# Altium project Joystick.PrjPcb
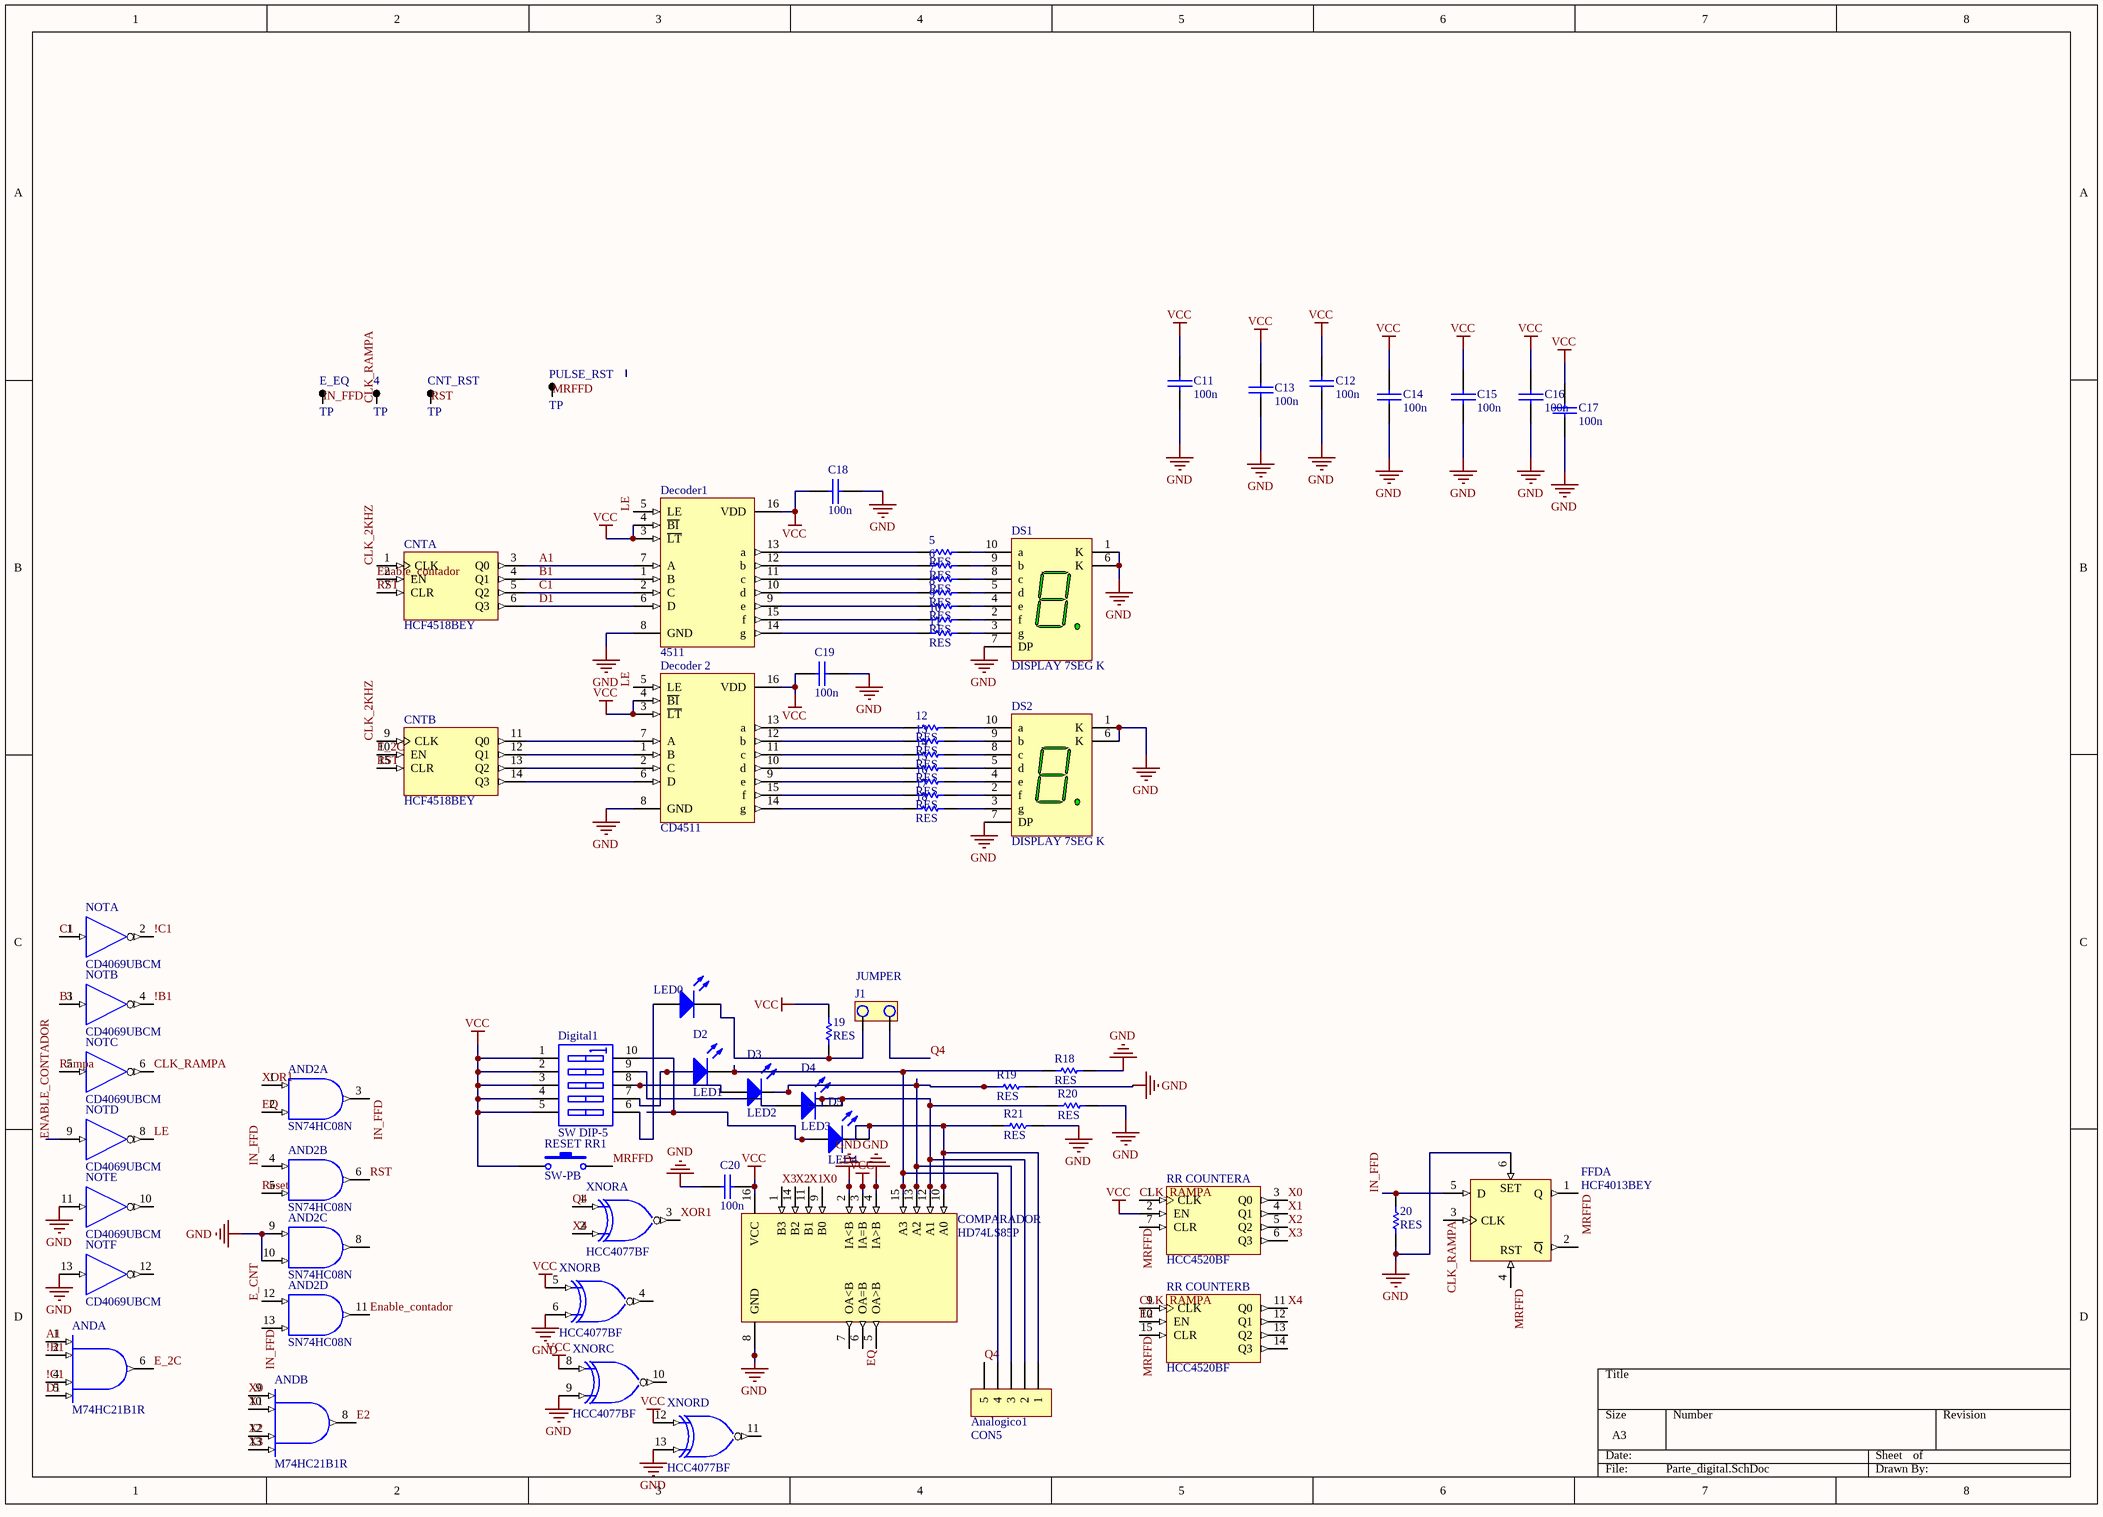
[diagram p0: Parte_digital.SchDoc]
2 sheets, 92 parts. Net scope: global (net labels, ports and power ports of the same name join across sheets).
Board files: Parte_digital.PcbDoc, PCB.PcbDoc
Sheets:
  Parte_digital.SchDoc
  Esquematico.SchDoc

## Sheet Parte_digital.SchDoc
size A3

### Parts
4  TP  [TPTH]
5  RES  [AXIAL-0.3]
6  RES  [AXIAL-0.3]
7  RES  [AXIAL-0.3]
8  RES  [AXIAL-0.3]
9  RES  [AXIAL-0.3]
10  RES  [AXIAL-0.3]
11  RES  [AXIAL-0.3]
12  RES  [AXIAL-0.3]
13  RES  [AXIAL-0.3]
14  RES  [AXIAL-0.3]
15  RES  [AXIAL-0.3]
16  RES  [AXIAL-0.3]
17  RES  [AXIAL-0.3]
18  RES  [AXIAL-0.3]
19  RES  [AXIAL-0.3]
20  RES  [AXIAL-0.3]
Analogico1  CON5  [SIP5]
AND  M74HC21B1R  [DIP14]  (parts A,B of 2)
AND2  SN74HC08N  [N014]  (parts A,B,C,D of 4)
C11  100n  [0805]
C12  100n  [0805]
C13  100n  [0805]
C14  100n  [0805]
C15  100n  [0805]
C16  100n  [0805]
C17  100n  [0805]
C18  100n  [0805]
C19  100n  [0805]
C20  100n  [0805]
CNT  HCF4518BEY  [DIP16]  (parts A,B of 2)
CNT_RST  TP  [TPTH]
COMPARADOR  HD74LS85P  [PRDP0016AE-B]
D1  LED0  [LED3]
D2  LED1  [LED3]
D3  LED2  [LED3]
D4  LED3  [LED3]
D5  LED4  [LED3]
Decoder1  4511  [DIP16]
Decoder_2  CD4511  [DIP16]
Digital1  SW DIP-5  [N10A]
DS1  DISPLAY 7SEG K  [DISPLAY_LED_0.3"]
DS2  DISPLAY 7SEG K  [DISPLAY_LED_0.3"]
E_EQ  TP  [TPTH]
FFD  HCF4013BEY  [DIP14]  (part A of 2)
J1  JUMPER  [JUMPER2]
NOT  CD4069UBCM  [DIP14]  (parts A,B,C,D,E,F of 6)
PULSE_RST  TP  [TPTH]
R18  RES  [AXIAL-0.3]
R19  RES  [AXIAL-0.3]
R20  RES  [AXIAL-0.3]
R21  RES  [AXIAL-0.3]
RESET_RR1  SW-PB  [SPST-2]
RR_COUNTER  HCC4520BF  [DIP16]  (parts A,B of 2)
XNOR  HCC4077BF  [CDIP14]  (parts A,B,C,D of 4)

### Nets
GND: 20.2 AND.7(GND) AND2.7(GND) AND2.9(A) AND2.10(B) C11.2 C12.2 C13.2 C14.2 C15.2 C16.2 C17.2 C18.2 C19.2 C20.2 CNT.8(GND) COMPARADOR.2(IA<B) COMPARADOR.4(IA>B) COMPARADOR.8(GND) Decoder1.8(GND) Decoder_2.8(GND) DS1.1(K) DS1.6(K) DS1.7(DP) DS2.1(K) DS2.6(K) DS2.7(DP) FFD.6(S) FFD.7(GND) NOT.7(GND) NOT.11(I) NOT.13(I) R18.1 R19.1 R20.1 R21.1 RR_COUNTER.8(GND) XNOR.6(D) XNOR.7(GND) XNOR.9(F) XNOR.13(H)
VCC: 19.2 AND.14(VCC) AND2.14(VCC) C11.1 C12.1 C13.1 C14.1 C15.1 C16.1 C17.1 C18.1 C19.1 C20.1 COMPARADOR.3(IA=B) COMPARADOR.16(VCC) Decoder1.3(~{LT}) Decoder1.4(~{BI}) Decoder1.16(VDD) Decoder_2.3(~{LT}) Decoder_2.4(~{BI}) Decoder_2.16(VDD) Digital1.1(A1) Digital1.2(A2) Digital1.3(A3) Digital1.4(A4) Digital1.5(A5) RESET_RR1.1 RR_COUNTER.2(EN) XNOR.5(C) XNOR.8(E) XNOR.12(G) XNOR.14(VCC)
VDD: CNT.16(VDD) FFD.14(VDD) NOT.14(VDD) RR_COUNTER.16(VDD)
!B1: AND.2(B) NOT.4(O)
!C1: AND.4(C) NOT.2(O)
A1: AND.1(A) CNT.3(Q0) Decoder1.7(A)
B1: CNT.4(Q1) Decoder1.1(B) NOT.3(I)
C1: CNT.5(Q2) Decoder1.2(C) NOT.1(I)
CLK_2KHZ: CNT.1(CLK) CNT.9(CLK)
CLK_RAMPA: 4.1 FFD.3(CLK) NOT.6(O) RR_COUNTER.1(CLK) RR_COUNTER.9(CLK)
D1: AND.5(D) CNT.6(Q3) Decoder1.6(D)
E2: AND.8(Y) RR_COUNTER.10(EN)
E_2C: AND.6(Y) CNT.10(EN)
E_CNT: AND2.12(A)
Enable_contador: AND2.11(Y) CNT.2(EN) NOT.9(I)
EQ: AND2.2(B) COMPARADOR.6(OA=B)
IN_FFD: 20.1 AND2.3(Y) AND2.4(A) AND2.13(B) E_EQ.1 FFD.5(D)
LE: Decoder1.5(LE) Decoder_2.5(LE) NOT.8(O)
MRFFD: FFD.1(Q) FFD.4(RST) PULSE_RST.1 RESET_RR1.2 RR_COUNTER.7(CLR) RR_COUNTER.15(CLR)
Q4: Analogico1.5 J1.1 XNOR.1(A)
Rampa: NOT.5(I)
Reset: AND2.5(B)
RST: AND2.6(Y) CNT.7(CLR) CNT.15(CLR) CNT_RST.1
X0: AND.9(A) COMPARADOR.9(B0) RR_COUNTER.3(Q0)
X1: AND.10(B) COMPARADOR.11(B1) RR_COUNTER.4(Q1)
X2: AND.12(C) COMPARADOR.14(B2) RR_COUNTER.5(Q2)
X3: AND.13(D) COMPARADOR.1(B3) RR_COUNTER.6(Q3)
X4: RR_COUNTER.11(Q0) XNOR.2(B)
XOR1: AND2.1(A) XNOR.3(J)
Net5_1: 5.1 Decoder1.13(a)
Net5_2: 5.2 DS1.10(a)
Net6_1: 6.1 Decoder1.12(b)
Net6_2: 6.2 DS1.9(b)
Net7_1: 7.1 Decoder1.11(c)
Net7_2: 7.2 DS1.8(c)
Net8_1: 8.1 Decoder1.10(d)
Net8_2: 8.2 DS1.5(d)
Net9_1: 9.1 Decoder1.9(e)
Net9_2: 9.2 DS1.4(e)
Net10_1: 10.1 Decoder1.15(f)
Net10_2: 10.2 DS1.2(f)
Net11_1: 11.1 Decoder1.14(g)
Net11_2: 11.2 DS1.3(g)
Net12_1: 12.1 Decoder_2.13(a)
Net12_2: 12.2 DS2.10(a)
Net13_1: 13.1 Decoder_2.12(b)
Net13_2: 13.2 DS2.9(b)
Net14_1: 14.1 Decoder_2.11(c)
Net14_2: 14.2 DS2.8(c)
Net15_1: 15.1 Decoder_2.10(d)
Net15_2: 15.2 DS2.5(d)
Net16_1: 16.1 Decoder_2.9(e)
Net16_2: 16.2 DS2.4(e)
Net17_1: 17.1 Decoder_2.15(f)
Net17_2: 17.2 DS2.2(f)
Net18_1: 18.1 Decoder_2.14(g)
Net18_2: 18.2 DS2.3(g)
Net19_1: 19.1 D1.2(K) J1.2
NetAnalogico1_1: Analogico1.1 COMPARADOR.10(A0) D5.2(K) R21.2
NetAnalogico1_2: Analogico1.2 COMPARADOR.12(A1) D4.2(K) R20.2
NetAnalogico1_3: Analogico1.3 COMPARADOR.13(A2) D3.2(K) R19.2
NetAnalogico1_4: Analogico1.4 COMPARADOR.15(A3) D2.2(K) R18.2
NetCNT_11: CNT.11(Q0) Decoder_2.7(A)
NetCNT_12: CNT.12(Q1) Decoder_2.1(B)
NetCNT_13: CNT.13(Q2) Decoder_2.2(C)
NetCNT_14: CNT.14(Q3) Decoder_2.6(D)
NetD1_1: D1.1(A) Digital1.6(B5)
NetD2_1: D2.1(A) Digital1.7(B4)
NetD3_1: D3.1(A) Digital1.8(B3)
NetD4_1: D4.1(A) Digital1.9(B2)
NetD5_1: D5.1(A) Digital1.10(B1)

Not connected (* = marked no-connect by the designer): AND2 8(Y); COMPARADOR 5(OA>B) 7(OA<B); FFD 2(~{Q}); NOT 10(O) 12(O); RR_COUNTER 12(Q1) 13(Q2) 14(Q3); XNOR 4(K) 10(L) 11(M)

### Notes on the sheet
- (in symbol HCF4013BEY, part A) SET

### Library data of the parts
AND = M74HC21B1R: Dual 4-Input AND Gate; Note: Pins 3 and 11 are not connected and not drawn.; Published: 8-Jun-2000; LatestRevisionDate: 06-Jun-2005; LatestRevisionNote: Stylized 3D Model Added.; DatasheetVersion: Dec-1992; PackageVersion: Jan-1997; PackageReference: DIP14; Publisher: Altium Limited; PackageDescription: DIP; 14 Leads; Row Spacing 7.62 mm; Pitch 2.54 mm; ComponentLink1Description: Manufacturer Link; ComponentLink1URL: http://www.st.com/; ComponentLink2Description: Datasheet; ComponentLink2URL: http://www.st.com/stonline/products/literature/ds/1923/m74hc21.pdf
AND2 = SN74HC08N: Quadruple 2-Input Positive-AND Gate; Published: 8-Jun-2000; LatestRevisionDate: 04-Mar-2005; LatestRevisionNote: Stylized 3D Model Added.; DatasheetVersion: May-1997; PackageVersion: Oct-1995; PackageReference: N014; Publisher: Altium Limited; PackageDescription: DIP; 14 Leads; Row Spacing 7.62 mm; Pitch 2.54 mm; ComponentLink1Description: Manufacturer Link; ComponentLink1URL: http://www.ti.com/; ComponentLink2Description: Datasheet; ComponentLink2URL: http://www-s.ti.com/sc/ds/SN74HC08.pdf
C11-C20 = CAP
CNT = HCF4518BEY: Dual Up-Counter; Published: 8-Jun-2000; LatestRevisionDate: 06-Jun-2005; LatestRevisionNote: Stylized 3D Model Added.; DatasheetVersion: Jun-1989; PackageVersion: Apr-1996; PackageReference: DIP16; Publisher: Altium Limited; PackageDescription: DIP; 16 Leads; Row Spacing 7.62 mm; Pitch 2.54 mm; ComponentLink1Description: Manufacturer Link; ComponentLink1URL: http://www.st.com/; ComponentLink2Description: Datasheet; ComponentLink2URL: http://www.st.com/stonline/products/literature/ds/2082/hcf4518.pdf
COMPARADOR = HD74LS85P: 4-bit Magnitude Comparator; Published: 10-Feb-2010; DatasheetVersion: Rev.2.00, Feb-2005; PackageVersion: Sep-2005; PackageReference: PRDP0016AE-B; Publisher: Altium Limited; PackageDescription: DIP, Plastic, 16-Pin, Row Spacing 7.62 mm, Pitch 2.54 mm; Code_JEITA: P-DIP16-6.3x19.2-2.54; ComponentLink1Description: Manufacturer Link; ComponentLink1URL: http://sg.renesas.com/fmwk.jsp?cnt=hd74ls_root.jsp&fp=/products/standard_ic/general_purpose_logic/5v_standard_logic/hd74ls/; ComponentLink2Description: Datasheet; ComponentLink2URL: http://documentation.renesas.com/eng/products/logic/rej03d0421_hd74ls85.pdf; ComponentLink3Description: Packaging Specification; ComponentLink3URL: http://sg.renesas.com/media/products/common_info/package/pdf/ic/code/prdp0016ae_b.pdf
D1-D5 = LED0: Typical INFRARED GaAs LED; Published: 8-Jun-2000; LatestRevisionDate: 08-Jul-2005; LatestRevisionNote: Mech Layer 1 removed.; PackageReference: LED-0; Publisher: Altium Limited; PackageDescription: LED; 2 Leads
Decoder1 Decoder_2 = CD4511: BCD to 7 SEGMENTOS
Digital1 = SW DIP-5: DIP Switch, 5 Position, SPST; Published: 24-Mar-1999; LatestRevisionDate: 17-Jul-2002; LatestRevisionNote: Re-released for DXP Platform.; PackageReference: N10A; Publisher: Altium Limited
DS1 DS2 = DISPLAY 7SEG K: Display 7 Segmentos Catodo Común
FFD = HCF4013BEY: Dual D-Type Flip-Flop; Published: 8-Jun-2000; LatestRevisionDate: 06-Jun-2005; LatestRevisionNote: Stylized 3D Model Added.; DatasheetVersion: Jun-1989; PackageVersion: Jan-1997; PackageReference: DIP14; Publisher: Altium Limited; PackageDescription: DIP; 14 Leads; Row Spacing 7.62 mm; Pitch 2.54 mm; ComponentLink1Description: Manufacturer Link; ComponentLink1URL: http://www.st.com/; ComponentLink2Description: Datasheet; ComponentLink2URL: http://www.st.com/stonline/products/literature/ds/2023/hcf4013.pdf
NOT = CD4069UBCM: Hex Inverter, 14-Pin SOIC; IC_Technology: C; Published: 17-Jul-2002; LatestRevisionDate: 13-Apr-2006; LatestRevisionNote: IPC-7351 Footprint Added.; DatasheetVersion: Jan-1999; PackageVersion: 2000; PackageReference: M14A; Publisher: Altium Limited; PackageDescription: 14-Pin Small Outline Integrated Circuit 1.27 mm Pitch; Code_IPC: SOIC127P600-14; ComponentLink1Description: Manufacturer Link; ComponentLink1URL: http://www.fairchildsemi.com/; ComponentLink2Description: Datasheet; ComponentLink2URL: http://www.fairchildsemi.com/ds/CD%2FCD4069UBC.pdf
RESET_RR1 = SW-PB: Switch; Published: 24-Mar-1999; LatestRevisionDate: 17-Jul-2002; LatestRevisionNote: Re-released for DXP Platform.; PackageReference: SPST-2; Publisher: Altium Limited; PackageDescription: Switch; 2 Leads
RR_COUNTER = HCC4520BF: Dual Binary Up-Counter; Published: 8-Jun-2000; LatestRevisionDate: 06-Jun-2005; LatestRevisionNote: Stylized 3D Model Added.; DatasheetVersion: Jun-1989; PackageVersion: Apr-1996; PackageReference: DIP16; Publisher: Altium Limited; PackageDescription: DIP; 16 Leads; Row Spacing 7.62 mm; Pitch 2.54 mm; ComponentLink1Description: Manufacturer Link; ComponentLink1URL: http://www.st.com/
XNOR = HCC4077BF: Quad Exclusive NOR Gate; Published: 8-Jun-2000; LatestRevisionDate: 06-Jun-2005; LatestRevisionNote: Stylized 3D Model Added.; DatasheetVersion: Sep-1988; PackageReference: CDIP14; Publisher: Altium Limited; PackageDescription: DIP; 14 Leads; Row Spacing 7.62 mm; Pitch 2.54 mm; ComponentLink1Description: Manufacturer Link; ComponentLink1URL: http://www.st.com/

## Sheet Esquematico.SchDoc
size A3
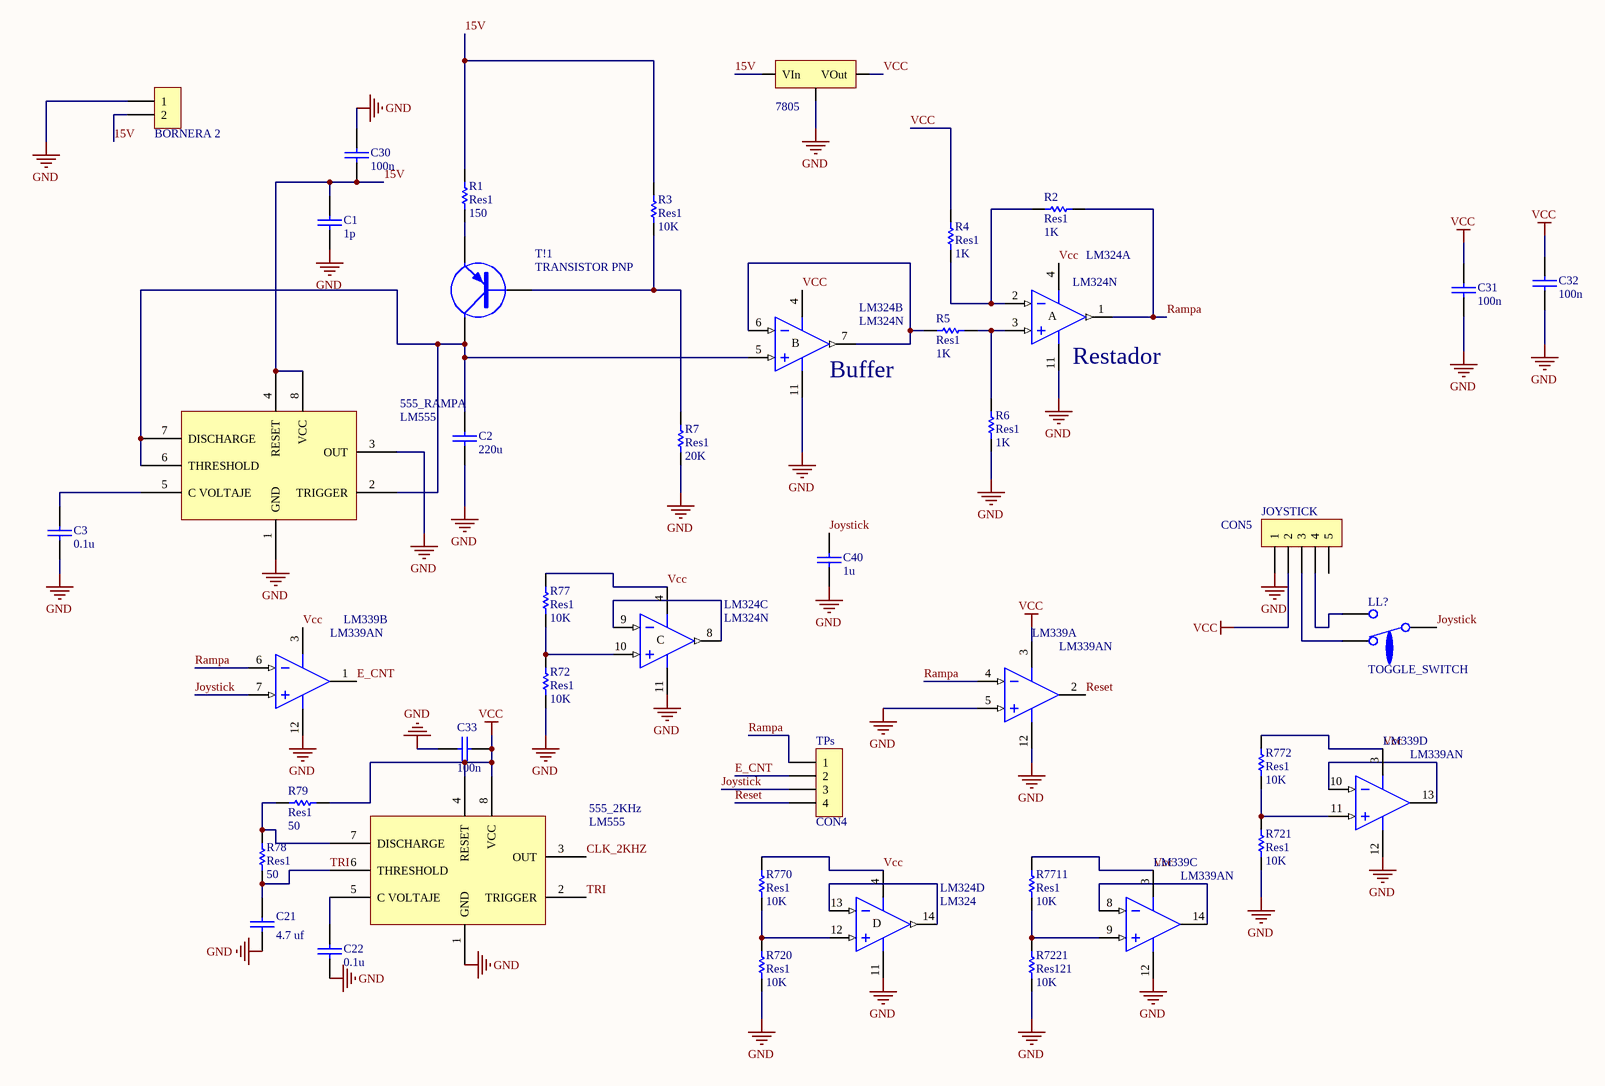
[diagram p1: Esquematico.SchDoc]

### Parts
555_2KHz  LM555  [DIP8]
555_RAMPA  LM555  [DIP8]
Alimentacion1  BORNERA 2  [BORNERA2]
C1  1p  [CAP100]
C2  220u  [CAP100]
C3  0.1u  [CAP100]
C21  4.7 uf  [CAP100]
C22  0.1u  [CAP100]
C30  100n  [0805]
C31  100n  [0805]
C32  100n  [0805]
C33  100n  [0805]
C40  1u  [CAP200]
JOYSTICK  CON5  [SIP5]
LL?  TOGGLE_SWITCH  [TOOGLE SWITCH SIMPLE]
LM324  LM324N  [N014]  (parts A,B,C,D of 4)
LM339  LM339AN  [646-06]  (parts A,B,C,D of 4)
R1  Res1  value 150  [AXIAL-0.3]
R2  Res1  value 1K  [AXIAL-0.3]
R3  Res1  value 10K  [AXIAL-0.3]
R4  Res1  value 1K  [AXIAL-0.3]
R5  Res1  value 1K  [AXIAL-0.3]
R6  Res1  value 1K  [AXIAL-0.3]
R7  Res1  value 20K  [AXIAL-0.3]
R72  Res1  value 10K  [AXIAL-0.3]
R77  Res1  value 10K  [AXIAL-0.3]
R78  Res1  value 50  [AXIAL-0.3]
R79  Res1  value 50  [AXIAL-0.3]
R720  Res1  value 10K  [AXIAL-0.3]
R721  Res1  value 10K  [AXIAL-0.3]
R770  Res1  value 10K  [AXIAL-0.3]
R772  Res1  value 10K  [AXIAL-0.3]
R7221  Res121  value 10K  [AXIAL-0.3]
R7711  Res1  value 10K  [AXIAL-0.3]
Regulador_de_Tensión  7805  [TO-220 V]
T!1  TRANSISTOR PNP  [TO92]
TPs  CON4  [SIP4]

### Nets
GND: 555_2KHz.1(GND) 555_RAMPA.1(GND) 555_RAMPA.3(OUT) Alimentacion1.1 C1.2 C2.2 C3.2 C21.2 C22.2 C30.2 C31.2 C32.2 C33.2 C40.2 JOYSTICK.1 LM324.11(V-) LM339.5(IN+) LM339.12(GND) R6.1 R7.1 R72.1 R720.1 R721.1 R7221.1 Regulador_de_Tensión.2(GND)
VCC: 555_2KHz.4(RESET) 555_2KHz.8(VCC) C31.1 C32.1 C33.1 JOYSTICK.2 LM324.4(V+) LM339.3(V+) R4.2 R77.2 R79.1 R770.2 R772.2 R7711.2 Regulador_de_Tensión.3(VOut)
15V: 555_RAMPA.4(RESET) 555_RAMPA.8(VCC) Alimentacion1.2 C1.1 C30.1 R1.2 R3.2 Regulador_de_Tensión.1(VIn)
CLK_2KHZ: 555_2KHz.3(OUT)
E_CNT: LM339.1(OUT) TPs.2
Joystick: C40.1 LL?.2(C) LM339.7(IN+) TPs.3
Rampa: LM324.1(OUT) LM339.4(IN-) LM339.6(IN-) R2.1 TPs.1
Reset: LM339.2(OUT) TPs.4
TRI: 555_2KHz.2(TRIGGER) 555_2KHz.6(THRESHOLD) C21.1 R78.1
Net555_2KHz_5: 555_2KHz.5(C_VOLTAJE) C22.1
Net555_2KHz_7: 555_2KHz.7(DISCHARGE) R78.2 R79.2
Net555_RAMPA_2: 555_RAMPA.2(TRIGGER) 555_RAMPA.6(THRESHOLD) 555_RAMPA.7(DISCHARGE) C2.1 LM324.5(IN+) T!1.2(C)
Net555_RAMPA_5: 555_RAMPA.5(C_VOLTAJE) C3.1
NetJOYSTICK_3: JOYSTICK.3 LL?.3(NC)
NetJOYSTICK_4: JOYSTICK.4 LL?.1(NA)
NetLM324_2: LM324.2(IN-) R2.2 R4.1
NetLM324_3: LM324.3(IN+) R5.1 R6.2
NetLM324_6: LM324.6(IN-) LM324.7(OUT) R5.2
NetLM324_8: LM324.8(OUT) LM324.9(IN-)
NetLM324_10: LM324.10(IN+) R72.2 R77.1
NetLM324_12: LM324.12(IN+) R720.2 R770.1
NetLM324_13: LM324.13(IN-) LM324.14(OUT)
NetLM339_8: LM339.8(IN-) LM339.14(OUT)
NetLM339_9: LM339.9(IN+) R7221.2 R7711.1
NetLM339_10: LM339.10(IN-) LM339.13(OUT)
NetLM339_11: LM339.11(IN+) R721.2 R772.1
NetR1_1: R1.1 T!1.3(E)
NetR3_1: R3.1 R7.2 T!1.1(B)

Not connected (* = marked no-connect by the designer): JOYSTICK 5

### Notes on the sheet
- (near LM324) Buffer
- (near LM324) Restador
- (in symbol LM324N, part A) A
- (in symbol LM324N, part B) B
- (in symbol LM324N, part C) C
- (in symbol LM324N, part D) D

### Library data of the parts
555_2KHz 555_RAMPA = LM555: Timer
C1-C3 C21 C22 C30-C33 C40 = CAP
LL? = TOGGLE_SWITCH: Pulsador con reteción
LM324 = LM324N: Quadruple Operational Amplifier; Published: 16-Jan-2001; LatestRevisionDate: 04-Mar-2005; LatestRevisionNote: Stylized 3D Model Added.; DatasheetVersion: Feb-1997; PackageVersion: Oct-1995; PackageReference: N014; Publisher: Altium Limited; PackageDescription: DIP; 14 Leads; Row Spacing 7.62 mm; Pitch 2.54 mm; ComponentLink1Description: Manufacturer Link; ComponentLink1URL: http://www.ti.com/; ComponentLink2Description: Datasheet; ComponentLink2URL: http://www-s.ti.com/sc/ds/lm324.pdf
LM339 = LM339AN: Quad Single-Supply Comparator; Published: 17-Jul-2002; LatestRevisionDate: 06-Jun-2005; LatestRevisionNote: Stylized 3D Model Added.; DatasheetVersion: 1988; PackageVersion: 1997; PackageReference: 646-06; Publisher: Altium Limited; PackageDescription: DIP; 14 Leads; Row Spacing 7.62 mm; Pitch 2.54 mm; ComponentLink1Description: Manufacturer Link; ComponentLink1URL: http://www.onsemi.com/site/products/taxonomy/0,4438,133,00.html
R1-R7 R72 R77-R79 R720 R721 R770 R772 R7221 R7711 = Res1: Resistor; Published: 8-Jun-2000; LatestRevisionDate: 17-Jul-2002; LatestRevisionNote: Re-released for DXP Platform.; PackageReference: AXIAL-0.3; Publisher: Altium Limited; PackageDescription: Axial Device, Thru-Hole; 2 Leads; 0.3 in Pin Spacing
Regulador_de_Tensión = 78XX: REGULDOR POSITIVO

## Nets that join several sheets
GND: Parte_digital (41 pins), Esquematico (25 pins)
VCC: Parte_digital (32 pins), Esquematico (15 pins)
CLK_2KHZ: Parte_digital (CNT.1 CNT.9), Esquematico (555_2KHz.3)
E_CNT: Parte_digital (AND2.12), Esquematico (LM339.1 TPs.2)
Rampa: Parte_digital (NOT.5), Esquematico (5 pins)
Reset: Parte_digital (AND2.5), Esquematico (LM339.2 TPs.4)